# EAGLE design diode_sampling_gate (EAGLE 9.2.2)
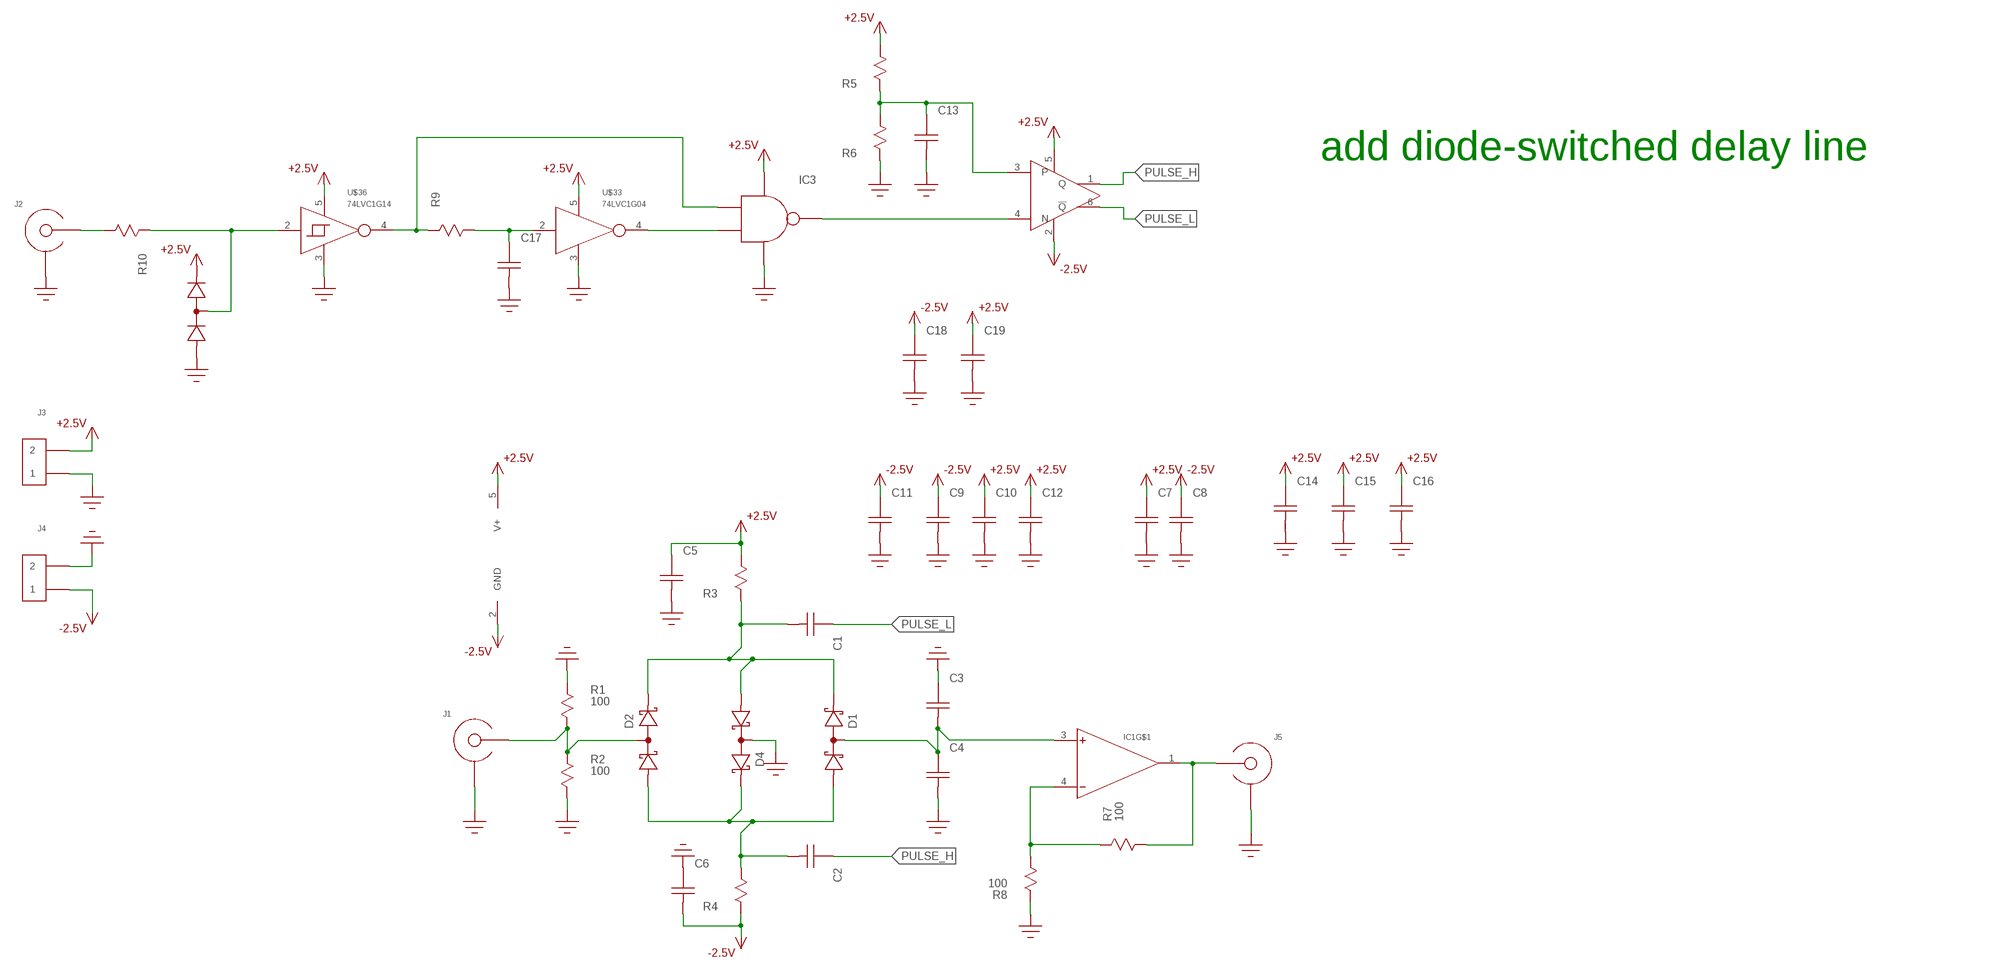
[diagram p0: schematic, sheet 1]

## Parts
C1  C0603  [C0603]
C2  C0603  [C0603]
C3  C0603  [C0603]
C4  C0603  [C0603]
C5  C0603  [C0603]
C6  C0603  [C0603]
C7  C  [C0402]
C8  C  [C0402]
C9  C0603  [C0603]
C10  C0603  [C0603]
C11  C0805  [0805]
C12  C0805  [0805]
C13  C0603  [C0603]
C14  C0603  [C0603]
C15  C0603  [C0603]
C16  C0603  [C0603]
C17  C0603  [C0603]
C18  C0805  [0805]
C19  C0805  [0805]
D1  BAS40-04  [SOT-23]
D2  BAS40-04  [SOT-23]
D4  BAS40-04  [SOT-23]
IC1  MCP6V81  [SOT23-5]
IC2  ADCMP606  [SC70-6]
IC3  74LVC1G00  [SOT23-5]
J1  EDGE_LAUNCH_JACK  [EDGE_LAUNCH_RF_CON]
J2  EDGE_LAUNCH_JACK  [EDGE_LAUNCH_RF_CON]
J3  HEADER_2PIN  [HEADER_2PIN]
J4  HEADER_2PIN  [HEADER_2PIN]
J5  EDGE_LAUNCH_JACK  [EDGE_LAUNCH_RF_CON]
R1  100  R0603  [R0603]
R2  100  R0603  [R0603]
R3  R0603  [R0603]
R4  R0603  [R0603]
R5  R0603  [R0603]
R6  R0603  [R0603]
R7  100  R0603  [R0603]
R8  100  R0603  [R0603]
R9  R0603  [R0603]
R10  R0603  [R0603]
U$33  74LVC1G04  [SOT23-5]
U$36  74LVC1G14  [SOT23-5]
U$46  MMBD7000L  [SOT-23]

## Nets
+2.5V: C5.P$2 C7.2 C10.P$2 C12.P$2 C14.P$2 C15.P$2 C16.P$2 C19.P$2 IC1.5(V+) IC2.5(VCC) IC3.5(VCC) J3.2 R3.P$2 R5.P$2 U$33.5(VCC) U$36.5(VCC) U$46.2(CATHODE)
-2.5V: C6.P$1 C8.2 C9.P$2 C11.P$2 C18.P$2 IC1.2(GND) IC2.2(VEE) J4.1 R4.P$1
GND: C3.P$2 C4.P$1 C5.P$1 C6.P$2 C7.1 C8.1 C9.P$1 C10.P$1 C11.P$1 C12.P$1 C13.P$1 C14.P$1 C15.P$1 C16.P$1 C17.P$1 C18.P$1 C19.P$1 D4.3(COMMON) IC3.3(GND) J1.GND@1(SHIELD) J1.GND@2(SHIELD) J1.GND@3(SHIELD) J1.GND@4(SHIELD) J1.GND@5(SHIELD) J1.GND@6(SHIELD) J1.GND@7(SHIELD) J1.GND@8(SHIELD) J1.GND@9(SHIELD) J1.GND@10(SHIELD) J1.GND@11(SHIELD) J1.GND@12(SHIELD) J1.SHIELD@1(SHIELD) J1.SHIELD@2(SHIELD) J2.GND@1(SHIELD) J2.GND@2(SHIELD) J2.GND@3(SHIELD) J2.GND@4(SHIELD) J2.GND@5(SHIELD) J2.GND@6(SHIELD) J2.GND@7(SHIELD) J2.GND@8(SHIELD) J2.GND@9(SHIELD) J2.GND@10(SHIELD) J2.GND@11(SHIELD) J2.GND@12(SHIELD) J2.SHIELD@1(SHIELD) J2.SHIELD@2(SHIELD) J3.1 J4.2 J5.GND@1(SHIELD) J5.GND@2(SHIELD) J5.GND@3(SHIELD) J5.GND@4(SHIELD) J5.GND@5(SHIELD) J5.GND@6(SHIELD) J5.GND@7(SHIELD) J5.GND@8(SHIELD) J5.GND@9(SHIELD) J5.GND@10(SHIELD) J5.GND@11(SHIELD) J5.GND@12(SHIELD) J5.SHIELD@1(SHIELD) J5.SHIELD@2(SHIELD) R1.P$1 R2.P$2 R6.P$1 R8.P$1 U$33.3(GND) U$36.3(GND) U$46.1(ANODE)
N$1: D2.3(COMMON) J1.CENTER R1.P$2 R2.P$1
N$2: C13.P$2 IC2.3(P) R5.P$1 R6.P$2
N$3: C1.P$1 D1.2(CATHODE) D2.2(CATHODE) D4.1(ANODE) R3.P$1
N$4: IC2.4(N) IC3.4(Y)
N$5: C2.P$1 D1.1(ANODE) D2.1(ANODE) D4.2(CATHODE) R4.P$2
N$6: IC1.4(-) R7.P$1 R8.P$2
N$7: IC1.1(OUT) J5.CENTER R7.P$2
N$8: IC3.1(B) U$33.4(OUT)
N$9: J2.CENTER R10.P$2
N$10: C3.P$1 C4.P$2 D1.3(COMMON) IC1.3(+)
N$11: IC3.2(A) R9.P$1 U$36.4(OUT)
N$12: C17.P$2 R9.P$2 U$33.2(IN)
N$13: R10.P$1 U$36.2(IN) U$46.3(COMMON)
PULSE_H: C2.P$2 IC2.1(Q)
PULSE_L: C1.P$2 IC2.6(!Q!)

## Notes on the sheet
- add diode-switched delay line

## Library data of the parts
C1-C19 = yapo:C
D1 D2 D4 = yapo:BAS40-04
IC1 = yapo:MCP6V81
IC2 = yapo:ADCMP606
IC3 = yapo:74LVC1G00
J1 J2 J5 = yapo:EDGE_LAUNCH_JACK
J3 J4 = yapo:HEADER_2PIN
R1-R10 = yapo:R
U$33 = yapo:74LVC1G04
U$36 = yapo:74LVC1G14
U$46 = yapo:MMBD7000L

## Board
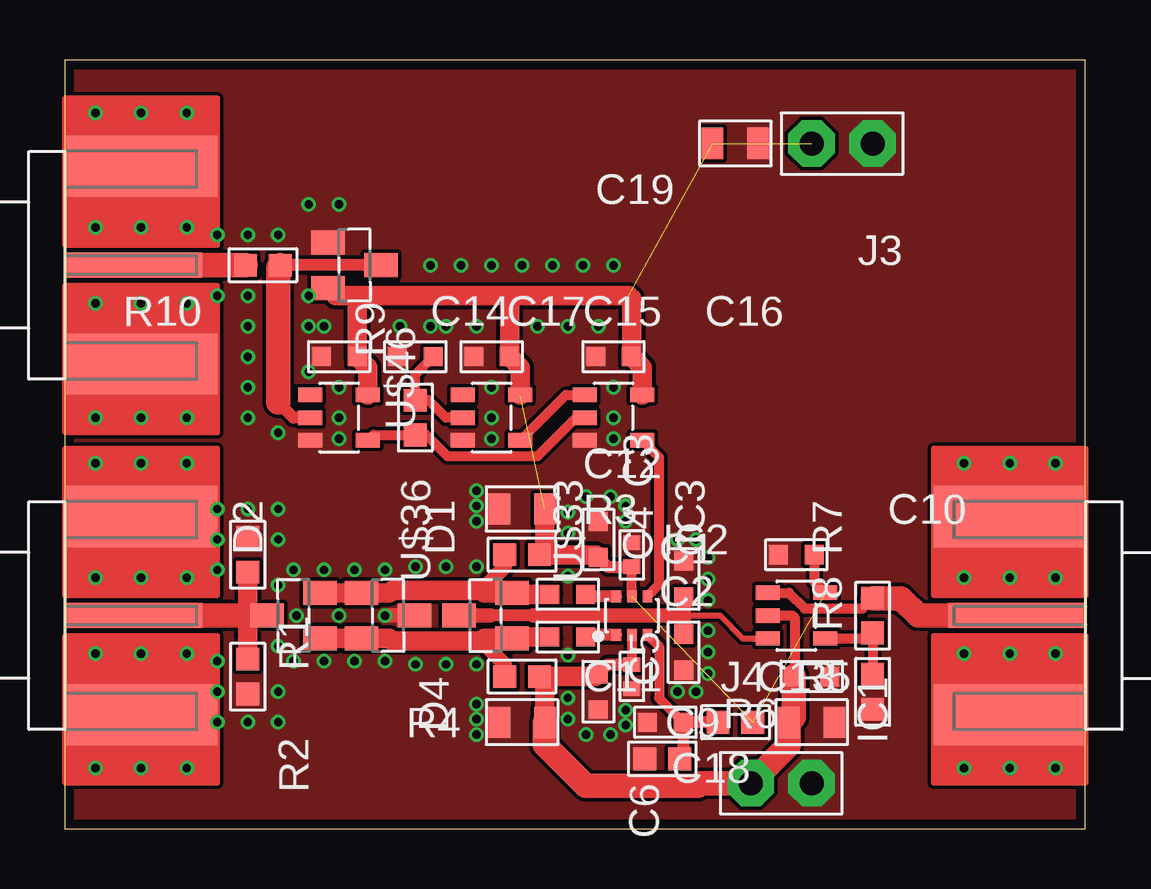
[diagram p1: board, top side]
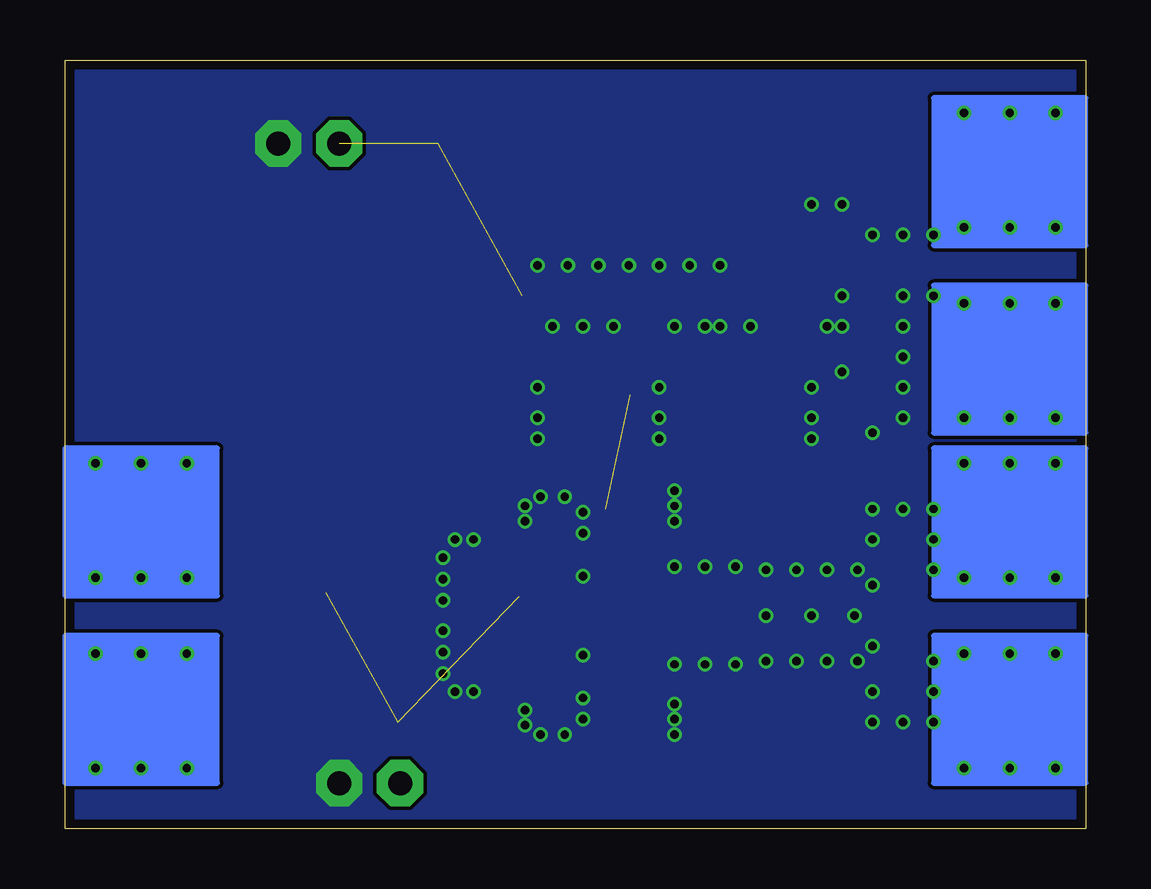
[diagram p2: board, bottom side, seen from below]

Size 42.52 x 32.05 mm. Coordinates in mm from the lower left corner, seen from the top.
Outline: 0,0 42.52,0 42.52,32.05 0,32.05 0,0
Copper layers (1*16): Top 0.035559375mm / dielectric 1.6mm / Bottom 0.035559375mm
Design rules "oshpark-2layer *": minimum track width 6mil, minimum drill 10mil, track to track 6mil, track to pad 6mil, pad to pad 6mil, via to via 6mil, smd to smd 6mil, copper to edge 15mil, drill to drill 6mil, minimum pad ring 5mil, minimum via ring 5mil, stop-mask expansion 2.5mil, vias tented up to drill 20mil, thermal gap 10mil

### Footprints (pad centres in the part's own frame; a part is rotated, then mirrored left to right if it is on the bottom)
C0603 = smd 0.8 x 0.8: P$1 -0.75,0; P$2 0.75,0
C0402 = smd 0.6 x 0.7: 1 -0.5,0; 2 0.5,0
0805 = smd 0.9 x 1.3: P$1 -0.95,0; P$2 0.95,0
SOT-23 = smd 1 x 1.4: 1 -0.95,-1.1; 2 0.95,-1.1; 3 0,1.1
SOT23-5 = smd 0.6 x 1: 1 -0.95,-1.2; 2 0,-1.2; 3 0.95,-1.2; 4 0.95,1.2; 5 -0.95,1.2
SC70-6 = smd 0.4 x 0.5: 1 -0.65,-0.8; 2 0,-0.8; 3 0.65,-0.8; 4 0.65,0.8; 5 0,0.8; 6 -0.65,0.8
EDGE_LAUNCH_RF_CON = smd 5.715 x 1.041: CENTER -2.875,0 | drill 0.35: GND@1 -5.08,1.587; GND@2 -3.175,1.587; GND@3 -1.27,1.587; GND@4 -5.08,-1.587; GND@5 -3.175,-1.587; GND@6 -1.27,-1.587; GND@7 -5.08,6.35; GND@8 -3.175,6.35; GND@9 -1.27,6.35; GND@10 -5.08,-6.35; GND@11 -3.175,-6.35; GND@12 -1.27,-6.35 | smd 6.35 x 2.54: SHIELD@1 -3.175,-4.128; SHIELD@2 -3.175,4.128
HEADER_2PIN = drill 1 pad 1.93 octagon: 1 -1.27,0; 2 1.27,0
R0603 = smd 0.95 x 0.95: P$1 -0.725,0; P$2 0.725,0

### Placement (x,y rotation side)
C1  20.95,9.78 0 top
C2  20.95,8 0 top
C3  25.78,10.41 90 top
C4  25.78,7.37 90 top
C5  22.23,12.06 270 top
C6  22.23,5.71 270 top
C7  23.62,11.43 270 top
C8  23.62,6.35 90 top
C9  31.11,6.35 180 top
C10  30.48,11.43 0 top
C11  19.05,4.45 0 top
C12  19.05,13.34 0 top
C13  25.02,4.45 0 top
C14  11.43,19.68 0 top
C15  17.78,19.68 0 top
C16  22.86,19.68 0 top
C17  14.61,19.68 0 top
C18  31.11,4.45 180 top
C19  27.94,28.57 180 top
D1  17.53,8.89 90 top
D2  9.53,8.89 90 top
D4  13.46,8.89 270 top
IC1  30.48,8.89 270 top
IC2  23.62,8.89 0 top
IC3  22.86,17.14 270 top
J1  0,8.89 180 top
J2  0,23.5 180 top
J3  32.38,28.57 180 top
J4  29.84,1.91 0 top
J5  42.55,8.89 0 top
R1  7.62,11.43 270 top
R2  7.62,6.35 270 top
R3  19.05,11.43 0 top
R4  19.05,6.35 180 top
R5  27.94,4.45 0 top
R6  24.89,2.92 0 top
R7  33.66,8.89 90 top
R8  33.66,5.71 90 top
R9  14.61,17.14 90 top
R10  8.26,23.5 180 top
U$33  17.78,17.14 270 top
U$36  11.43,17.14 270 top
U$46  12.06,23.5 270 top

### Tracks (layer width: path | path; a pad name or v marks a point on that pad's centre or on a via)
+2.5V  (5 unrouted)
  Top 0.406: IC2.5 C7.2 | C10.P$2 31.23,10.29 IC1.5
  Top 0.508: C5.P$2 22.61,10.93 C7.2
  Top 0.813: U$36.5 12.63,19.23 C14.P$2 12.18,22.11 12.06,22.23 | U$33.5 18.98,19.23 C15.P$2 18.53,22.11 18.41,22.23 | IC3.5 24.06,19.23 C16.P$2 23.61,22.11 23.5,22.23 18.41,22.23 | C5.P$2 22.11,11.43 R3.P$2 20,11.65 C12.P$2 | U$46.2 11.29,22.23 12.06,22.23 | 12.06,22.23 18.41,22.23
-2.5V
  Top 0.406: IC2.2 C8.2 | IC1.2 30.32,8.89 30.4,8.81 30.4,6.39 C9.P$2
  Top 0.508: C6.P$1 22.61,6.85 C8.2
  Top 0.813: C6.P$1 22.11,6.35 R4.P$1 20,6.12 C11.P$2
  Top 1.016: C11.P$2 20,3.5 21.71,1.79 26.37,1.79 26.48,1.91 J4.1 30.16,3.5 C18.P$2 30.36,4.64 C9.P$2
GND  (via drill 0.35)
  Top 0.61: D4.3 v13.34,8.89
  other vias: 7.62,13.34 7.62,4.45 6.35,6.99 6.35,10.79 6.35,12.06 8.89,12.06 8.89,5.71 6.35,5.71 11.43,8.89 9.65,8.89 10.79,10.79 12.06,10.79 10.79,6.99 12.06,6.99 13.34,6.99 14.61,6.86 22.73,3.94 13.34,10.79 14.61,10.92 15.88,10.92 9.53,10.79 9.53,6.99 8.89,7.62 8.89,10.16 8.89,13.34 8.89,4.45 6.35,4.45 6.35,13.34 17.14,10.92 17.14,6.86 21.72,3.94 22.73,13.84 21.72,13.84 15.88,6.86 20.95,10.54 20.95,7.24 7.62,22.23 7.62,20.95 7.62,19.68 7.62,18.41 7.62,17.14 8.89,16.51 10.16,26.04 10.16,20.95 13.97,20.95 17.14,20.95 11.43,17.14 22.23,20.95 17.78,17.14 22.86,17.14 22.86,16.26 17.78,16.26 11.43,16.26 11.43,18.41 17.78,18.41 22.86,18.41 20.95,12.32 20.95,5.46 17.14,14.1 17.14,13.46 17.14,12.83 17.14,5.21 17.14,4.57 17.14,3.94 20.95,4.57 20.95,13.21 25.53,12.06 26.29,12.06 25.53,5.71 26.29,5.71 26.8,7.37 26.8,6.48 26.8,10.41 26.8,11.3 26.8,8.26 26.8,9.53 23.37,12.83 23.37,4.95 23.37,13.46 23.37,4.32 15.24,20.95 15.24,23.5 16.51,23.5 17.78,23.5 19.05,23.5 20.32,23.5 21.59,23.5 22.86,23.5 20.95,20.95 19.68,20.95 10.79,20.95 15.88,20.95 11.43,26.04 6.35,24.77 7.62,24.77 6.35,22.23 8.89,24.77 10.16,22.23 10.16,19.05
  pour Bottom (no thermals): 0,0 43.81,0 43.81,32.38 0,32.38
  pour Top (no thermals): 0,0 43.81,0 43.81,32.38 0,32.38
N$1
  Top 0.813: R1.P$2 7.62,8.89 R2.P$1
  Top 1.016: J1.CENTER 7.62,8.89 D2.3
N$2
  Top 0.406: IC2.3 24.77,7.6 24.77,5.45 C13.P$2
  Top 0.508: R6.P$2 25.77,3.07 C13.P$2 R5.P$1
N$3
  Top 0.61: R3.P$1 18.32,10.92 17.36,9.95
  Top 0.813: D2.2 D4.1 13.52,9.84 13.63,9.95 17.36,9.95 17.47,9.84 D1.2 18.69,9.78 C1.P$1
N$4
  Top 0.406: IC2.4 24.77,10.18 24.77,15.49 IC3.4
N$5
  Top 0.61: R4.P$2 18.32,6.86 17.36,7.83
  Top 0.813: D2.1 D4.2 13.52,7.94 13.63,7.83 17.36,7.83 17.47,7.94 D1.1 18.69,8 C2.P$1
N$6
  Top 0.406: IC1.4 33.43,7.94 R7.P$1 R8.P$2
N$7
  Top 0.406: IC1.1 30.16,9.84 30.82,9.18 33.22,9.18 R7.P$2
  Top 1.016: J5.CENTER 35.56,8.89 34.84,9.62 R7.P$2
N$8
  Top 0.406: 19.05,16.27 U$33.4 20.88,18.09 IC3.1
N$9
  Top 1.016: J2.CENTER R10.P$2
N$10
  Top 0.254: 25.78,8.89 27.3,8.89 28.25,7.94 IC1.3
  Top 0.508: 19.52,8.89 17.73,8.89
  Top 0.61: 17.73,8.89 D1.3 | C3.P$1 25.78,8.89 | 25.78,8.89 C4.P$2 | 25.78,8.89 19.52,8.89
N$11
  Top 0.406: U$36.4 12.86,16.42 R9.P$1 15.05,16.42 15.93,15.54 19.7,15.54 21.31,17.14 IC3.2
N$12
  Top 0.406: U$33.2 15.88,17.14 15.15,17.87 R9.P$2 14.61,18.93 C17.P$2
N$13
  Top 0.508: U$36.2 9.53,17.14 8.89,17.78 | U$46.3 R10.P$1
  Top 1.016: 8.89,17.78 8.89,23.41 R10.P$1
PULSE_H
  Top 0.508: IC2.1 21.79,8.09
  Top 0.61: 21.79,8.09 C2.P$2
PULSE_L
  Top 0.508: IC2.6 21.79,9.69
  Top 0.61: 21.79,9.69 C1.P$2